# EAGLE design controller (EAGLE 9.2.2)

## Sheet 1 of 3
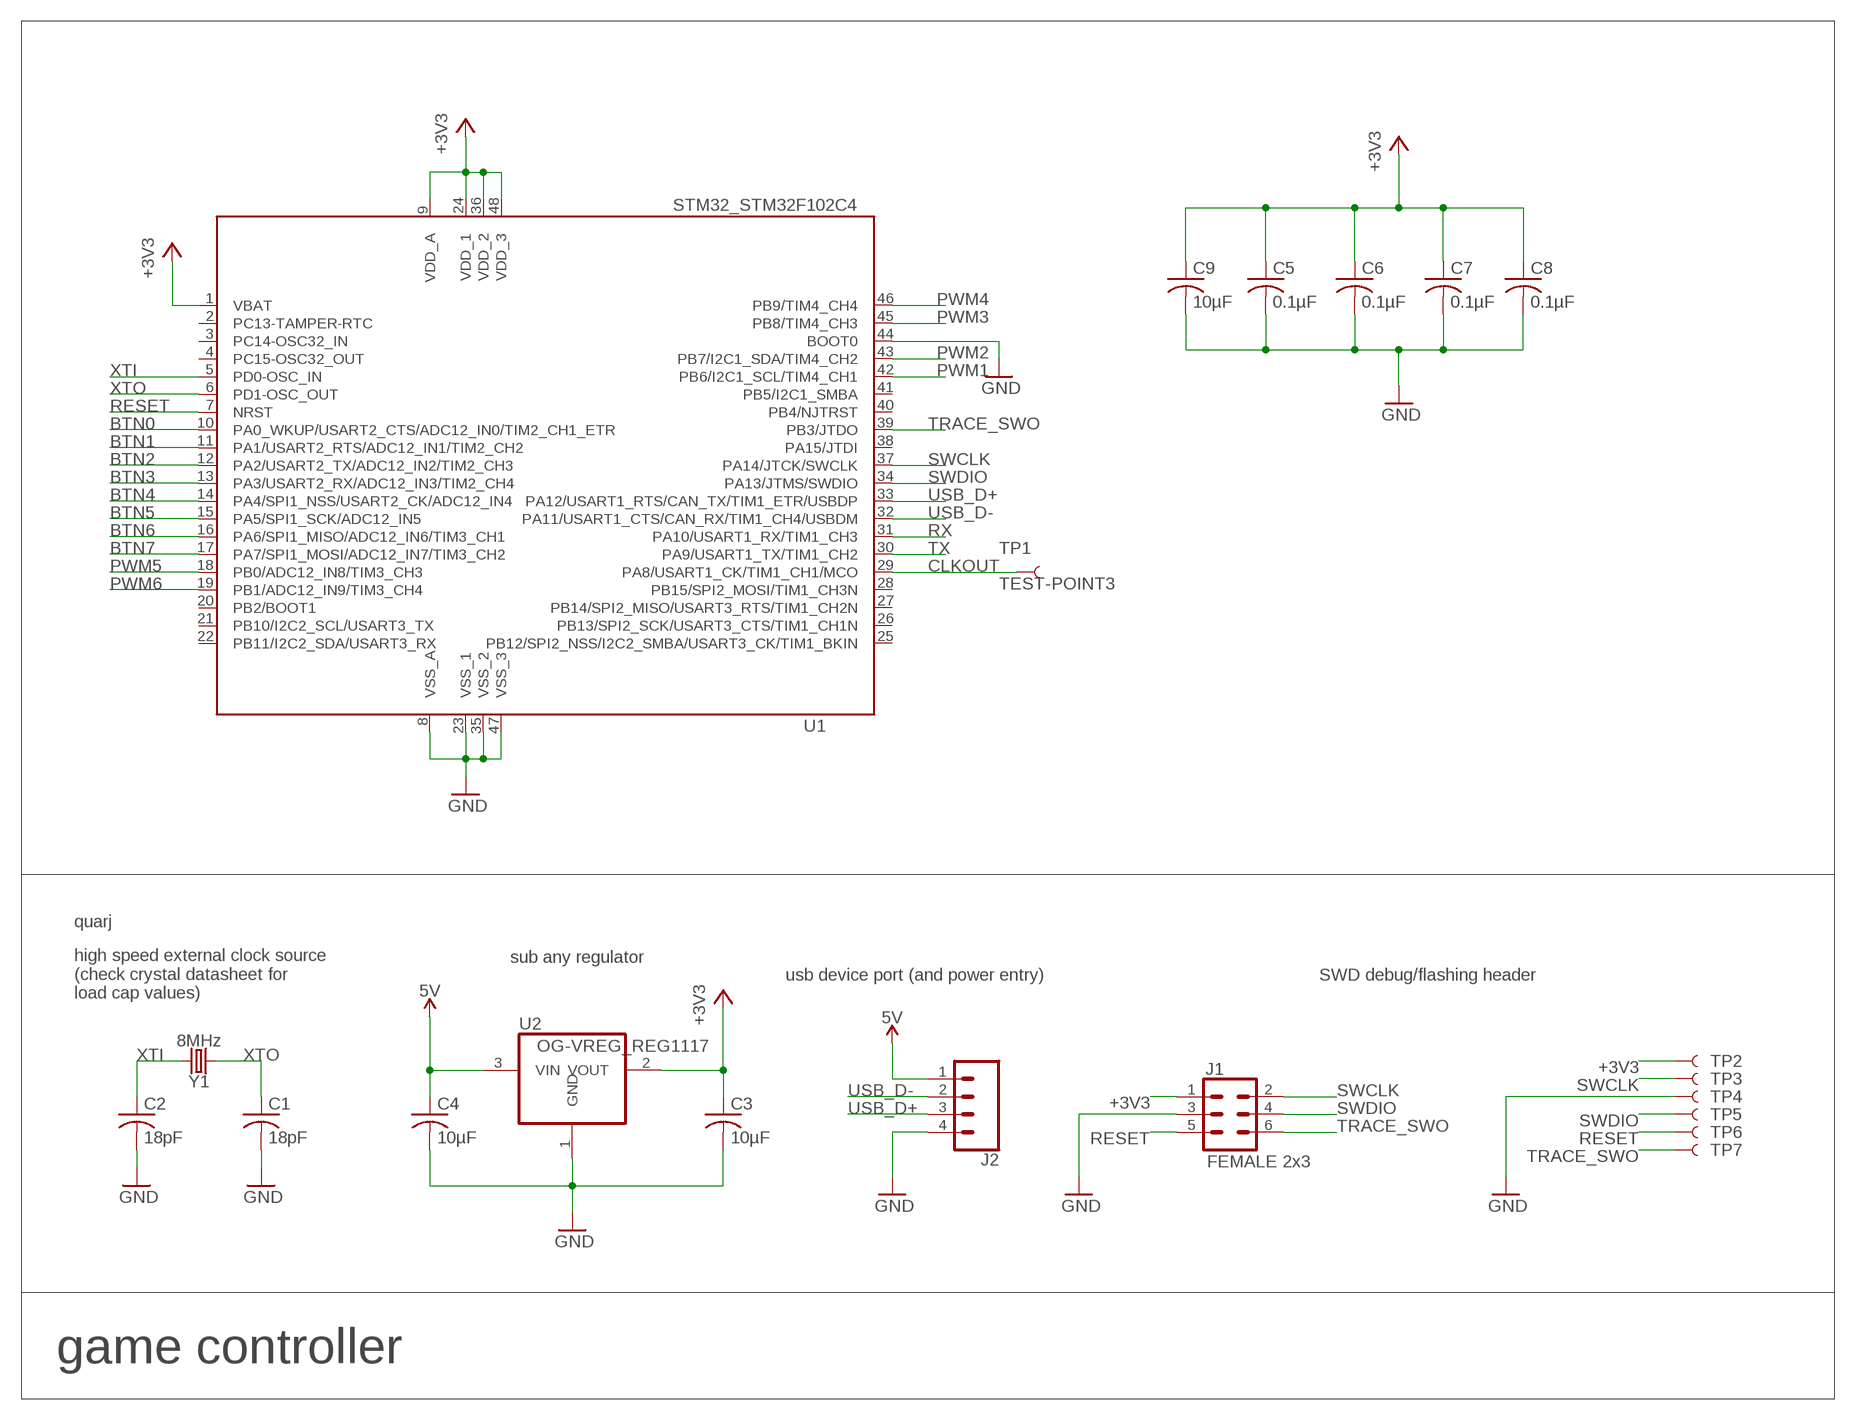
[diagram p0: schematic, sheet 1]

### Parts
C1  18pF  RCL_C-USC0805K  [RCL_C0805K]
C2  18pF  RCL_C-USC0805K  [RCL_C0805K]
C3  10µF  RCL_C-USC0805K  [RCL_C0805K]
C4  10µF  RCL_C-USC0805K  [RCL_C0805K]
C5  0.1µF  RCL_C-USC0805K  [RCL_C0805K]
C6  0.1µF  RCL_C-USC0805K  [RCL_C0805K]
C7  0.1µF  RCL_C-USC0805K  [RCL_C0805K]
C8  0.1µF  RCL_C-USC0805K  [RCL_C0805K]
C9  10µF  RCL_C-USC0805K  [RCL_C0805K]
J1  FEMALE 2x3  CONN_03X2FEMALE  [2X3]
J2  CONN_04  [1X04]
TP1  TEST-POINT3  [PAD.03X.03]
TP2  TEST-POINT3  [PAD.03X.03]
TP3  TEST-POINT3  [PAD.03X.03]
TP4  TEST-POINT3  [PAD.03X.03]
TP5  TEST-POINT3  [PAD.03X.03]
TP6  TEST-POINT3  [PAD.03X.03]
TP7  TEST-POINT3  [PAD.03X.03]
U1  STM32_STM32F102C4  [STM32_LQFP48]
U2  OG-VREG_REG1117  [OG-VREG_SOT223]
Y1  8MHz  CRYSTAL-8MHZSMD-HC49UP  [HC49UP]

### Nets
5V: C4.1 J2.1 U2.3(VIN)
+3V3: C3.1 C5.1 C6.1 C7.1 C8.1 C9.1 J1.1 TP2.P$1 U1.1(VBAT) U1.9(VDD_A) U1.24(VDD_1) U1.36(VDD_2) U1.48(VDD_3) U2.2(VOUT) ; also sheet 2
BTN0: U1.10(PA0_WKUP/USART2_CTS/ADC12_IN0/TIM2_CH1_ETR) ; also sheet 2
BTN1: U1.11(PA1/USART2_RTS/ADC12_IN1/TIM2_CH2) ; also sheet 2
BTN2: U1.12(PA2/USART2_TX/ADC12_IN2/TIM2_CH3) ; also sheet 3
BTN3: U1.13(PA3/USART2_RX/ADC12_IN3/TIM2_CH4) ; also sheet 3
BTN4: U1.14(PA4/SPI1_NSS/USART2_CK/ADC12_IN4) ; also sheet 3
BTN5: U1.15(PA5/SPI1_SCK/ADC12_IN5) ; also sheet 3
BTN6: U1.16(PA6/SPI1_MISO/ADC12_IN6/TIM3_CH1) ; also sheet 3
BTN7: U1.17(PA7/SPI1_MOSI/ADC12_IN7/TIM3_CH2) ; also sheet 3
CLKOUT: TP1.P$1 U1.29(PA8/USART1_CK/TIM1_CH1/MCO)
GND: C1.2 C2.2 C3.2 C4.2 C5.2 C6.2 C7.2 C8.2 C9.2 J1.3 J2.4 TP4.P$1 U1.8(VSS_A) U1.23(VSS_1) U1.35(VSS_2) U1.44(BOOT0) U1.47(VSS_3) U2.1(GND) ; also sheet 2,3
PWM1: U1.42(PB6/I2C1_SCL/TIM4_CH1) ; also sheet 2
PWM2: U1.43(PB7/I2C1_SDA/TIM4_CH2) ; also sheet 2
PWM3: U1.45(PB8/TIM4_CH3) ; also sheet 2
PWM4: U1.46(PB9/TIM4_CH4) ; also sheet 2
PWM5: U1.18(PB0/ADC12_IN8/TIM3_CH3) ; also sheet 2
PWM6: U1.19(PB1/ADC12_IN9/TIM3_CH4) ; also sheet 2
RESET: J1.5 TP6.P$1 U1.7(NRST)
RX: U1.31(PA10/USART1_RX/TIM1_CH3)
SWCLK: J1.2 TP3.P$1 U1.37(PA14/JTCK/SWCLK)
SWDIO: J1.4 TP5.P$1 U1.34(PA13/JTMS/SWDIO)
TRACE_SWO: J1.6 TP7.P$1 U1.39(PB3/JTDO)
TX: U1.30(PA9/USART1_TX/TIM1_CH2)
USB_D+: J2.3 U1.33(PA12/USART1_RTS/CAN_TX/TIM1_ETR/USBDP)
USB_D-: J2.2 U1.32(PA11/USART1_CTS/CAN_RX/TIM1_CH4/USBDM)
XTI: C2.1 U1.5(PD0-OSC_IN) Y1.2
XTO: C1.1 U1.6(PD1-OSC_OUT) Y1.1
Unconnected: U1.2(PC13-TAMPER-RTC) U1.3(PC14-OSC32_IN) U1.4(PC15-OSC32_OUT) U1.20(PB2/BOOT1) U1.21(PB10/I2C2_SCL/USART3_TX) U1.22(PB11/I2C2_SDA/USART3_RX) U1.25(PB12/SPI2_NSS/I2C2_SMBA/USART3_CK/TIM1_BKIN) U1.26(PB13/SPI2_SCK/USART3_CTS/TIM1_CH1N) U1.27(PB14/SPI2_MISO/USART3_RTS/TIM1_CH2N) U1.28(PB15/SPI2_MOSI/TIM1_CH3N) U1.38(PA15/JTDI) U1.40(PB4/NJTRST) U1.41(PB5/I2C1_SMBA)

### Notes on the sheet
- quarj
- sub any regulator
- usb device port (and power entry) | SWD debug/flashing header
- high speed external clock source
  (check crystal datasheet for 
  load cap values)
- game controller

## Sheet 2 of 3
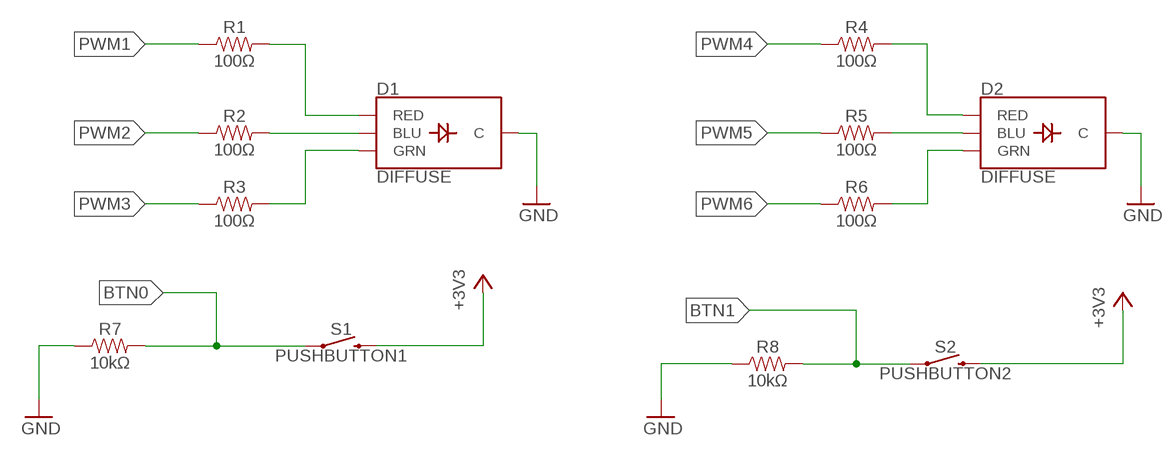
[diagram p1: schematic, sheet 2]

### Parts
D1  DIFFUSE  LED-RGB-CCDIFFUSE  [LED-RGB-THRU]
D2  DIFFUSE  LED-RGB-CCDIFFUSE  [LED-RGB-THRU]
R1  100Ω  0.3OHM-0805-1/8W-1%  [0805]
R2  100Ω  0.3OHM-0805-1/8W-1%  [0805]
R3  100Ω  0.3OHM-0805-1/8W-1%  [0805]
R4  100Ω  0.3OHM-0805-1/8W-1%  [0805]
R5  100Ω  0.3OHM-0805-1/8W-1%  [0805]
R6  100Ω  0.3OHM-0805-1/8W-1%  [0805]
R7  10kΩ  0.3OHM-0805-1/8W-1%  [0805]
R8  10kΩ  0.3OHM-0805-1/8W-1%  [0805]
S1  PUSHBUTTON1  MOMENTARY-SWITCH-SPST-PTH-6.0MM  [TACTILE_SWITCH_PTH_6.0MM]
S2  PUSHBUTTON2  MOMENTARY-SWITCH-SPST-PTH-6.0MM  [TACTILE_SWITCH_PTH_6.0MM]

### Nets
+3V3: S1.3 S2.3 ; also sheet 1
BTN0: R7.2 S1.1 ; also sheet 1
BTN1: R8.2 S2.1 ; also sheet 1
GND: D1.2(C) D2.2(C) R7.1 R8.1 ; also sheet 1,3
N$1: D1.1(RED) R1.2
N$2: D1.4(BLU) R2.2
N$3: D1.3(GRN) R3.2
N$4: D2.4(BLU) R5.2
N$5: D2.1(RED) R4.2
N$6: D2.3(GRN) R6.2
PWM1: R1.1 ; also sheet 1
PWM2: R2.1 ; also sheet 1
PWM3: R3.1 ; also sheet 1
PWM4: R4.1 ; also sheet 1
PWM5: R5.1 ; also sheet 1
PWM6: R6.1 ; also sheet 1

## Sheet 3 of 3
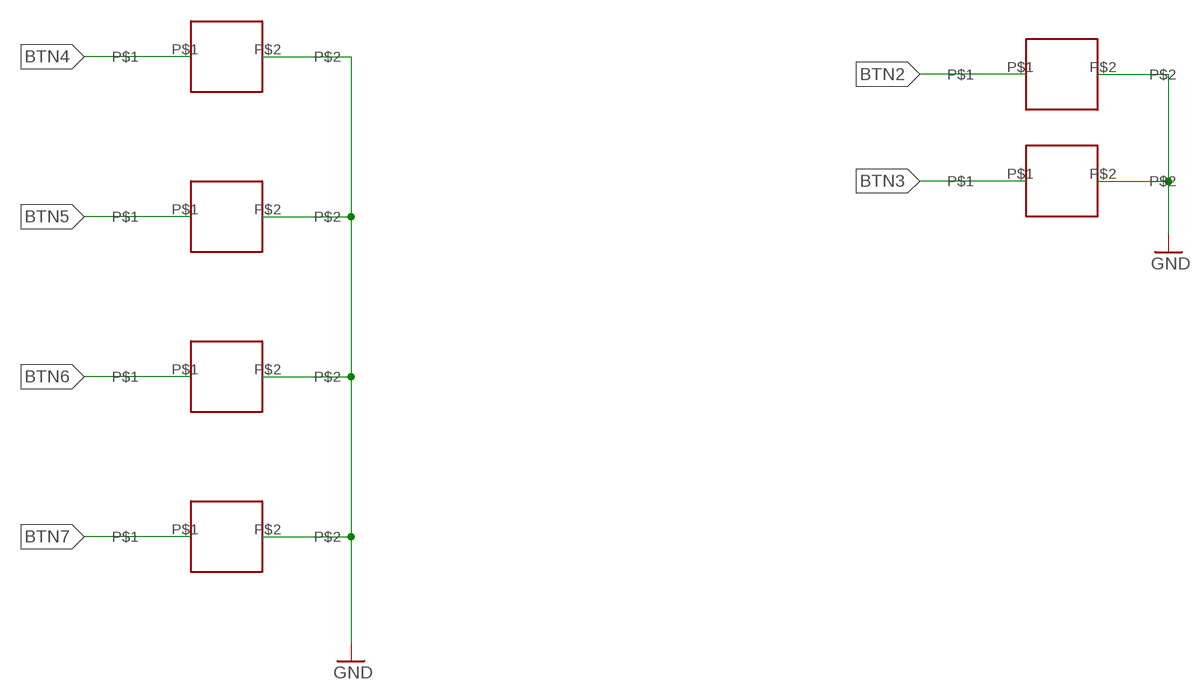
[diagram p2: schematic, sheet 3]

### Parts
A  HYPERKIN_TOUCHPAD_CADET  [HYPERKIN_TOUCHPLATE_CADET]
B  HYPERKIN_TOUCHPAD_CADET  [HYPERKIN_TOUCHPLATE_CADET]
D  HYPERKIN_TOUCHPAD_CADET  [HYPERKIN_TOUCHPLATE_CADET]
L  HYPERKIN_TOUCHPAD_CADET  [HYPERKIN_TOUCHPLATE_CADET]
R  HYPERKIN_TOUCHPAD_CADET  [HYPERKIN_TOUCHPLATE_CADET]
U  HYPERKIN_TOUCHPAD_CADET  [HYPERKIN_TOUCHPLATE_CADET]

### Nets
BTN2: A.P$1 ; also sheet 1
BTN3: B.P$1 ; also sheet 1
BTN4: U.P$1 ; also sheet 1
BTN5: D.P$1 ; also sheet 1
BTN6: L.P$1 ; also sheet 1
BTN7: R.P$1 ; also sheet 1
GND: A.P$2 B.P$2 D.P$2 L.P$2 R.P$2 U.P$2 ; also sheet 1,2

## Library data of the parts
A B D L R U = hyperkin_cadet_touchplate:HYPERKIN_TOUCHPAD_CADET
C1-C9 = braids_v50:RCL_C-US: CAPACITOR, American symbol
D1 D2 = SparkFun-LED:LED-RGB-CC: LED-RGB Common Cathode Packages: LED RGB-THRU LED_PIRANHA_5MM SparkFun Products: RGB Diffused Common Cathode- Diffuse <[https://www.sparkfun.com/products/9264]> RGB Diffused Common Cathode - Clear <[https://www.sparkfun.com/products/105]> LED-RGB 5mm Square (Piranha) <[https://www.sparkfun.com/products/11679]>; PROD_ID: DIO-09434
J1 = SparkFun-Connectors:CONN_03X2: Multi connection point. Often used as Generic Header-pin footprint for 0.1 inch spaced/style header connections You can populate with any combo of single row headers, but if you'd like an exact match, check these: Header - 2x3 (Male, 0.1") <https://www.sparkfun.com/products/12807> (PRT-12807) Header - 2x3 (Female, 0.1") <https://www.sparkfun.com/products/13010> (PRT-13010) 2x3 Pin Shrouded Header <https://www.sparkfun.com/products/10877> (PRT-10877) On any of the 0.1 inch spaced packages, you can populate with these: Break Away Headers - Straight <https://www.sparkfun.com/products/116> (PRT-00116) Break Away Male Headers - Right Angle <https://www.sparkfun.com/products/553> (PRT-00553) Female Headers <https://www.sparkfun.com/products/115> (PRT-00115) Break Away Headers - Machine Pin <https://www.sparkfun.com/products/117> (PRT-00117) Break Away Female Headers - Swiss Machine Pin <https://www.sparkfun.com/products/743> (PRT-00743) Special note: the shrouded connector mates well with our 3x2 ribbon cables: Ribbon Crimp Connector - 6-pin (2x3, Female) <https://www.sparkfun.com/products/10651> (PRT-10651) Ribbon Cable - 6 wire (15ft) <https://www.sparkfun.com/products/10646> (PRT-10646); PROD_ID: CONN-11566
J2 = SparkFun-Connectors:CONN_04: Multi connection point. Often used as Generic Header-pin footprint for 0.1 inch spaced/style header connections On any of the 0.1 inch spaced packages, you can populate with these: Break Away Headers - Straight <https://www.sparkfun.com/products/116> (PRT-00116) Break Away Male Headers - Right Angle <https://www.sparkfun.com/products/553> (PRT-00553) Female Headers <https://www.sparkfun.com/products/115> (PRT-00115) Break Away Headers - Machine Pin <https://www.sparkfun.com/products/117> (PRT-00117) Break Away Female Headers - Swiss Machine Pin <https://www.sparkfun.com/products/743> (PRT-00743) For SCREWTERMINALS and SPRING TERMINALS visit here: Screw Terimnals on SparkFun.com <https://www.sparkfun.com/search/results?term=Screw+Terminals> (5mm/3.5mm/2.54mm spacing) This device is also useful as a general connection point to wire up your design to another part of your project. Our various solder wires solder well into these plated through hole pads. Hook-Up Wire - Assortment (Stranded, 22 AWG) <https://www.sparkfun.com/products/11375> (PRT-11375) Hook-Up Wire - Assortment (Solid Core, 22 AWG) <https://www.sparkfun.com/products/11367> (PRT-11367) View the entire wire category on our website here <https://www.sparkfun.com/categories/141> Special notes: Molex polarized connector foot print use with SKU : PRT-08231 with associated crimp pins and housings. 1MM SMD Version SKU: PRT-10208; PROD_ID: CONN-09696
R1-R8 = SparkFun-Resistors:0.3OHM: 0.3Ω resistor A resistor is a passive two-terminal electrical component that implements electrical resistance as a circuit element. Resistors act to reduce current flow, and, at the same time, act to lower voltage levels within circuits. - Wikipedia; PROD_ID: RES-11622; VALUE: 0.3
S1 S2 = SparkFun-Switches:MOMENTARY-SWITCH-SPST: Momentary Switch (Pushbutton) - SPST Normally-open (NO) SPST momentary switches (buttons, pushbuttons). Variants PTH-12MM - 12mm square, through-hole Momentary Pushbutton Switch - 12mm Square <https://www.sparkfun.com/products/9190> (COM-09190) PTH-6.0MM, PTH-6.0MM-KIT - 6.0mm square, through-hole Mini Pushbutton Switch <https://www.sparkfun.com/products/97> (COM-00097) KIT package intended for soldering kit's - only one side of pads' copper is exposed. PTH-RIGHT-ANGLE-KIT - Right-angle, through-hole Right Angle Tactile Button <https://www.sparkfun.com/products/10791> - Used on SparkFun BigTime Watch Kit <https://www.sparkfun.com/products/11734> SMD-12MM - 12mm square, surface-mount Tactile Button - SMD (12mm) <https://www.sparkfun.com/products/12993> (COM-12993) Used on SparkFun PicoBoard <https://www.sparkfun.com/products/11888> SMD-4.5MM - 4.5mm Square Trackball Switch Used on SparkFun Blackberry Trackballer Breakout <https://www.sparkfun.com/products/13169> SMD-4.6MMX2.8MM - 4.60mm x 2.80mm, surface mount Used on SparkFun SAMD21 Mini Breakout <https://www.sparkfun.com/products/13664> SMD-5.2MM, SMD-5.2-REDUNDANT - 5.2mm square, surface-mount Mini Pushbutton Switch - SMD <https://www.sparkfun.com/products/8720> (COM-08720) Used on Arduino Pro Mini <https://www.sparkfun.com/products/11114> REDUNDANT package connects both switch circuits together SMD-6.0X3.5MM - 6.0 x 3.5mm, surface mount Momentary Reset Switch SMD <https://www.sparkfun.com/products/8229> (COM-08229) SMD-6.2MM-TALL - 6.2mm square, surface mount Tactile Button - SMD (6mm) <https://www.sparkfun.com/products/12992> Used on SparkFun Digital Sandbox <https://www.sparkfun.com/products/12651> SMD-RIGHT-ANGLE - Right-angle, surface mount Used on SparkFun Block for Intel® Edison - Arduino <https://www.sparkfun.com/products/13036>; PROD_ID: SWCH-08441; SF_SKU: COM-00097
TP1-TP7 = SparkFun-Connectors:TEST-POINT: SparkFun Test Points Bare copper test points for troubleshooting or In-Circuit-Testing. These are used by our Production team for verifying production board runs using pogo-pins on test beds. SparkFun Products: SparkFun LSM9DS1 Breakout <https://www.sparkfun.com/products/13284> SparkFun PSOC <https://www.sparkfun.com/products/13714> SparkFun Load Cell Amplifier <https://www.sparkfun.com/products/13879>
U1 = braids_v50:STM32_STM32F102C4
U2 = braids_v50:OG-VREG_REG1117: 800mA and 1A Low Dropout (LDO) Positive Regulator 1.8V, 2.5V, 2.85V, 3.3V, 5V, and Adj
Y1 = SparkFun-Clocks:CRYSTAL-8MHZ: 8MHz Crystal Datasheet Example <http://www.futureelectronics.com/en/technologies/electromechanical/timing-devices/crystals/Pages/6008189-ABM3B-8.000MHZ-B2-T.aspx?IM=0> Frequency: 8MHz Frequency Tolerance: ±20ppm Load Capacitance: 18pF SparkFun Products: Pro Micro -3.3V/8MHz <https://www.sparkfun.com/products/12587> WAV Trigger <https://www.sparkfun.com/products/13660>; PROD_ID: XTAL-11706

## Board
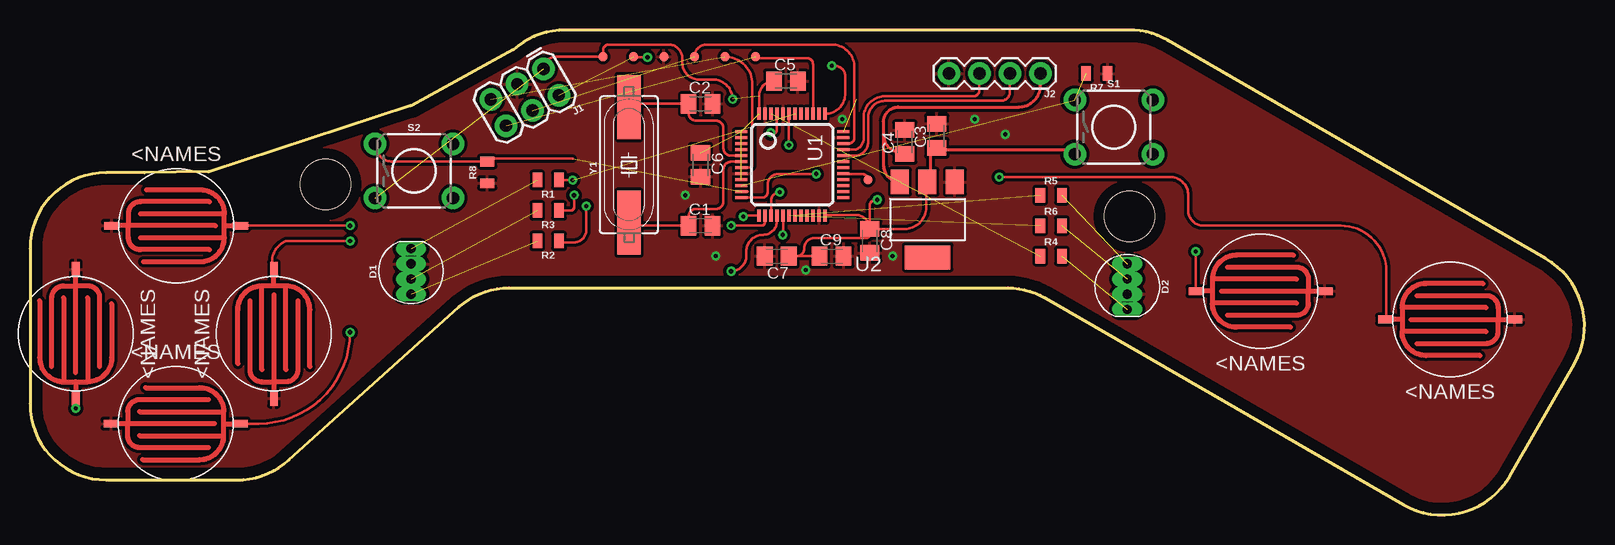
[diagram p3: board, top side]
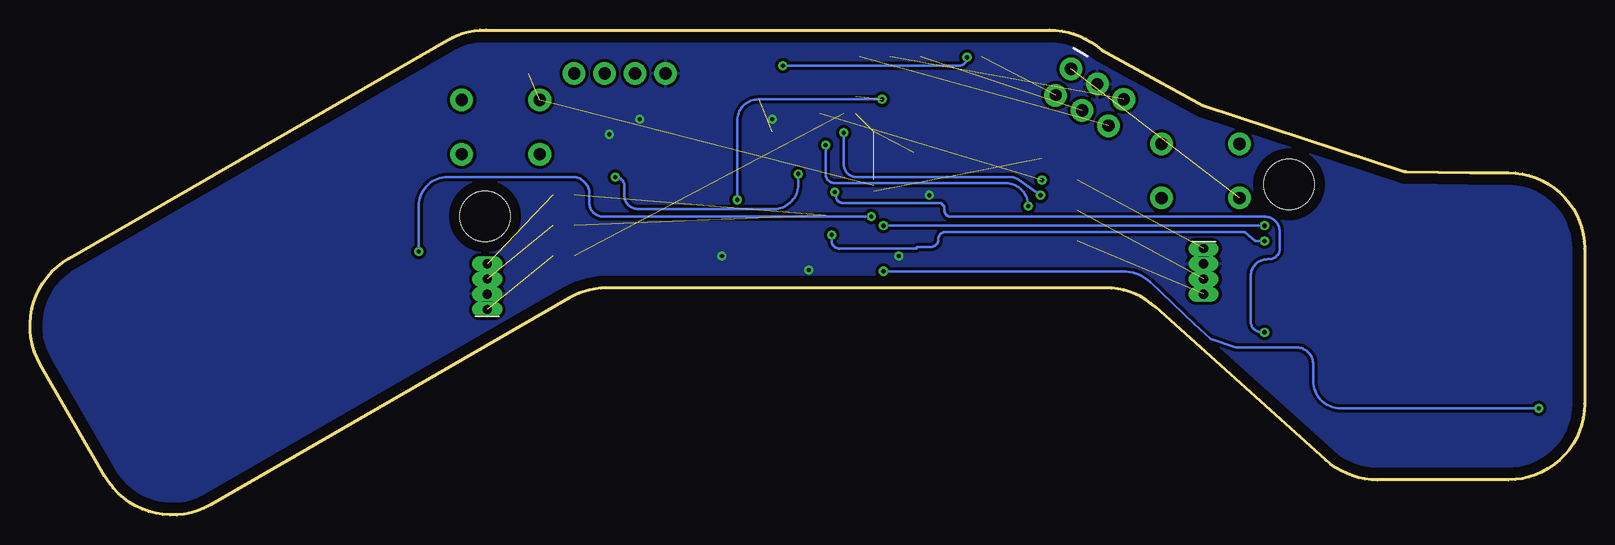
[diagram p4: board, bottom side, seen from below]

Size 129.54 x 40.45 mm. Coordinates in mm from the lower left corner, seen from the top.
Outline: 114.47,0.86 arc90 123.3,3.23 128.68,12.56 arc90 126.32,21.39 94.79,39.59 arc30 91.56,40.45 44.59,40.45 arc42 40.27,38.79 31.79,34.15 31.72,34.12 14.96,28.64 arc-17 14.85,28.62 9.53,28.55 6.35,28.55 arc90 0,22.2 0,9.28 arc90 6.35,2.93 17.25,2.93 arc42 21.58,4.59 35.74,17.33 arc-42 39.91,18.94 81.49,18.94 arc-30 84.61,18.1 114.47,0.86
Copper layers (1*16): Top 0.035mm / dielectric 1.5mm / Bottom 0.035mm
Design rules "default *": minimum track width 6mil, minimum drill 0.35mm, track to track 6mil, track to pad 6mil, pad to pad 6mil, via to via 6mil, smd to smd 6mil, copper to edge 35mil, drill to drill 6mil, minimum pad ring 10mil, minimum via ring 8mil, stop-mask expansion 4mil, vias tented up to drill 0mil, thermal gap 10mil
Holes 4.19 mm at 24.62,27.57 91.64,24.9

### Footprints (pad centres in the part's own frame; a part is rotated, then mirrored left to right if it is on the bottom)
HYPERKIN_TOUCHPLATE_CADET = smd 1.27 x 0.635: P$1 -5.35,0; P$2 5.37,0
RCL_C0805K = smd 1.3 x 1.6: 1 -1,0; 2 1,0
LED-RGB-THRU = drill 0.762 pad 0.889 long: 1 1.905,0; 2 0.635,0; 3 -0.635,0; 4 -1.905,0
2X3 = drill 1.016 pad 1.88: 1 0,0; 2 0,2.54; 3 2.54,0; 4 2.54,2.54; 5 5.08,0; 6 5.08,2.54
1X04 = drill 1.016 pad 1.88: 1 0,0; 2 2.54,0; 3 5.08,0; 4 7.62,0
0805 = smd 0.8 x 1.2: 1 -0.9,0; 2 0.9,0
TACTILE_SWITCH_PTH_6.0MM = drill 1.016 pad 1.88: 1 -3.251,2.261; 2 3.251,2.261; 3 -3.251,-2.261; 4 3.251,-2.261
PAD.03X.03 = smd 0.762 x 0.762: P$1 0,0
STM32_LQFP48 = smd 0.254 x 1: 1 -2.75,-4.25; 2 -2.25,-4.25; 3 -1.75,-4.25; 4 -1.25,-4.25; 5 -0.75,-4.25; 6 -0.25,-4.25; 7 0.25,-4.25; 8 0.75,-4.25; 9 1.25,-4.25; 10 1.75,-4.25; 11 2.25,-4.25; 12 2.75,-4.25; 25 2.75,4.25; 26 2.25,4.25; 27 1.75,4.25; 28 1.25,4.25; 29 0.75,4.25; 30 0.25,4.25; 31 -0.25,4.25; 32 -0.75,4.25; 33 -1.25,4.25; 34 -1.75,4.25; 35 -2.25,4.25; 36 -2.75,4.25 | smd 1 x 0.254: 13 4.25,-2.75; 14 4.25,-2.25; 15 4.25,-1.75; 16 4.25,-1.25; 17 4.25,-0.75; 18 4.25,-0.25; 19 4.25,0.25; 20 4.25,0.75; 21 4.25,1.25; 22 4.25,1.75; 23 4.25,2.25; 24 4.25,2.75; 37 -4.25,2.75; 38 -4.25,2.25; 39 -4.25,1.75; 40 -4.25,1.25; 41 -4.25,0.75; 42 -4.25,0.25; 43 -4.25,-0.25; 44 -4.25,-0.75; 45 -4.25,-1.25; 46 -4.25,-1.75; 47 -4.25,-2.25; 48 -4.25,-2.75
OG-VREG_SOT223 = smd 1.499 x 2.007: 1 -2.261,-3.15; 2 0.025,-3.15; 3 2.311,-3.15 | smd 3.81 x 2.007: 4 0,3.15
HC49UP = smd 5.334 x 1.93: 1 -4.826,0; 2 4.826,0

### Placement (x,y rotation side)
A  118.34,16.3 0 top
B  102.54,18.67 0 top
C1  55.88,24.13 0 top
C2  55.88,34.29 0 top
C3  75.56,31.62 90 top
C4  72.9,31.11 90 top
C5  62.99,36.19 0 top
C6  55.88,29.21 270 top
C7  62.23,21.59 180 top
C8  69.98,22.86 270 top
C9  66.8,21.59 0 top
D  12.14,7.62 180 top
D1  31.75,20.32 90 top
D2  91.44,19.05 270 top
J1  42.8,37.21 210 top
J2  84.2,36.83 180 top
L  3.81,15.11 90 top
R  20.32,15.11 270 top
R1  43.18,27.94 180 top
R2  43.18,22.86 180 top
R3  43.18,25.4 180 top
R4  85.09,21.59 0 top
R5  85.09,26.67 0 top
R6  85.09,24.13 0 top
R7  88.9,36.83 180 top
R8  38.1,28.57 90 top
S1  90.32,32.36 0 top
S2  32,28.7 0 top
TP1  69.85,27.94 0 top
TP2  47.75,38.22 90 top
TP3  50.29,38.22 90 top
TP4  52.83,38.22 90 top
TP5  55.37,38.22 90 top
TP6  57.91,38.22 90 top
TP7  60.45,38.22 90 top
U  12.19,24.13 180 top
U1  63.5,29.21 270 top
U2  74.8,24.63 180 top
Y1  49.91,29.21 90 top

### Tracks (layer width: path | path; a pad name or v marks a point on that pad's centre or on a via)
5V
  Top 0.254: U2.3 arc-90 71.12,29.16 71.12,31.75 | 71.12,31.75 71.12,32.76 arc-90 72.39,34.03 82.42,34.03 arc90 84.2,35.81 J2.1 | C4.1 72.9,30.22 72.64,30.22 arc-90 71.12,31.75
+3V3  (via drill 0.35)  (6 unrouted)
  Top 0.203: U1.24 arc-90 66.31,25.02 68.83,25.02 arc-90 69.98,23.87 C8.1 | C5.1 arc90 60.75,34.95 U1.48 | C8.1 arc-90 69.87,23.75 | U2.2 arc-90 74.68,27.68 74.68,25.65 arc-90 72.88,23.86 C8.1 | C9.1 C7.1 63.88,21.59 arc90 64.52,22.22 arc-90 65.41,23.11 69.72,23.11 arc90 69.98,23.36 C8.1 | C8.1 69.98,25.78 arc-90 70.48,26.29 v70.61,26.29 | v58.55,34.67 arc90 56.9,36.32 55.75,36.32 arc-90 54.36,37.72 54.36,38.1 arc90 53.21,39.24 48.26,39.24 arc90 47.75,38.73 TP2.P$1 43.81,38.22 arc90 J1.1
  Top 0.254: U2.2 arc90 75.06,28.06 75.06,30.35 arc-90 75.33,30.62 C3.1 arc90 75.71,30.48 86.69,30.48 arc-90 S1.3
  Bottom 0.203: v70.61,26.29 70.61,32.89 arc90 68.83,34.67 v58.55,34.67
BTN0  (2 unrouted)
BTN1  (1 unrouted)
  Top 0.203: U1.11 arc-90 59.27,26.97 59.82,26.97 | S2.1 arc90 30.24,29.47 R8.2 arc-90 38.34,29.71 45.21,29.71
BTN2  (via drill 0.35)
  Top 0.203: A.P$1 arc90 113.03,16.34 113.03,20.32 arc90 109.22,24.13 97.79,24.13 arc-90 96.52,25.4 96.52,26.67 arc90 95,28.19 v80.77,28.19 | U1.12 61,26.46 arc90 61.47,26.92 61.47,27.56 arc-90 62.36,28.44 v65.53,28.44
  Bottom 0.203: v80.77,28.19 arc90 80.01,27.43 80.01,26.67 arc-90 78.87,25.52 67.56,25.52 arc-90 65.53,27.56 v65.53,28.44
BTN3  (via drill 0.35)
  Top 0.203: B.P$1 arc-90 97.16,18.7 v97.16,21.97 | v59.44,24.89 arc-90 59.5,24.96 U1.13
  Bottom 0.203: v97.16,21.97 97.16,25.78 arc90 94.74,28.19 84.33,28.19 arc90 82.93,26.79 82.93,26.03 arc-90 81.79,24.89 v59.44,24.89
BTN4  (via drill 0.35)
  Top 0.203: U.P$1 v26.67,24.13 | v58.42,24.13 60.96,24.13 arc90 61.25,24.42 U1.14
  Bottom 0.203: v26.67,24.13 v58.42,24.13
BTN5  (via drill 0.35)
  Top 0.203: v26.67,15.24 arc-90 19.05,7.62 D.P$1 | v62.48,26.92 arc90 61.75,26.19 U1.15
  Bottom 0.203: v62.48,26.92 arc-90 62.36,26.79 62.36,26.54 arc-90 61.85,26.03 53.85,26.03 arc90 53.34,25.52 53.34,25.4 arc-90 52.83,24.89 26.67,24.89 arc90 25.4,23.62 25.4,22.22 arc90 26.29,21.33 26.42,21.33 arc-90 27.81,19.94 27.81,16.13 arc-90 26.92,15.24 v26.67,15.24
BTN6  (via drill 0.35)
  Top 0.203: L.P$1 v3.81,8.89 | v58.42,20.33 arc90 59.69,21.6 59.69,21.97 arc-90 61.09,23.36 arc90 62.25,24.53 U1.16
  Bottom 0.203: v3.81,8.89 20.32,8.89 arc90 22.61,11.17 22.61,12.57 arc-90 24,13.97 29.08,13.97 31.14,14.7 32.51,15.93 36.2,19.43 arc-40 38.23,20.32 v58.42,20.32 v58.42,20.33
BTN7  (via drill 0.35)
  Top 0.203: R.P$1 arc-90 21.32,22.86 v26.67,22.86 | v62.74,23.36 arc90 v62.75,23.38 U1.17
  Bottom 0.203: v26.67,22.86 27.43,22.86 28.32,23.62 53.21,23.62 arc-90 53.85,22.98 arc90 54.48,22.35 55.63,22.35 arc90 55.75,22.22 62.1,22.22 arc90 62.74,22.86 v62.74,23.36
CLKOUT
  Top 0.203: U1.29 arc90 67.76,28.44 69.34,28.44 arc-90 TP1.P$1
GND  (via drill 0.35)
  other vias: 54.61,26.67 71.88,21.59 57.15,21.59 64.64,20.44 78.74,33.02 81.28,31.75 67.69,33.02
  pour Top (isolate 0.254): 6.35,2.54 17.78,2.54 arc37 21.59,3.81 arc11 35.56,16.51 arc-53 40.77,18.54 81.28,18.54 83.82,17.78 115.7,-0.64 arc95 123.06,1.65 129.92,13.33 arc79 128.78,20.32 93.47,40.89 43.56,40.89 arc43 41.27,40 31.75,34.67 15.24,29.21 5.71,29.08 arc96 -0.64,21.84 -0.51,8.63 arc90 5.59,2.54
  pour Bottom (isolate 0.254): 5.08,2.54 17.78,2.54 arc37 21.59,3.81 arc11 35.56,16.51 arc-35 38.86,18.41 arc-16 40.64,18.54 81.28,18.54 83.82,17.78 106.3,4.82 115.06,-0.26 arc54 119.51,-0.51 arc34 123.95,3.3 arc3 129.54,12.7 arc73 128.52,20.44 93.98,40.64 93.47,40.89 43.56,40.89 arc43 41.27,40 32,34.79 15.24,29.21 4.95,29.08 arc90 -0.64,23.49 -0.64,20.06 -0.64,8.63 arc86
N$1  (1 unrouted)
N$2  (1 unrouted)
N$3  (1 unrouted)
N$4  (1 unrouted)
N$5  (1 unrouted)
N$6  (1 unrouted)
PWM1  (via drill 0.35)  (1 unrouted)
  Top 0.203: R1.1 v45.21,27.94
PWM2  (via drill 0.35)
  Top 0.203: R2.1 arc90 44.21,22.73 45.34,22.73 arc90 46.35,23.75 v46.35,25.78 | U1.43 arc90 U1.43 v63.25,30.86
  Bottom 0.203: v46.35,25.78 arc-90 48.26,27.68 62.48,27.68 arc90 63.25,28.44 v63.25,30.86
PWM3  (via drill 0.35)
  Top 0.203: R3.1 45.09,25.4 arc90 45.34,25.65 v45.34,26.67 | U1.45 arc90 62.23,33.44 62.23,32.13 arc-90 61.85,31.75 v61.72,31.87
  Bottom 0.203: v45.34,26.67 47.12,27.94 arc-39 48.01,28.19 60.71,28.19 arc90 61.72,29.21 v61.72,31.87
PWM4  (1 unrouted)
PWM5  (1 unrouted)
PWM6  (1 unrouted)
RESET  (1 unrouted)
  Top 0.203: U1.7 59.95,28.96 arc90 60.2,29.21 60.2,35.94 arc90 TP6.P$1
SWCLK  (via drill 0.35)  (1 unrouted)
  Top 0.203: U1.37 arc90 67.94,35.15 67.94,36.57 arc90 67.06,37.46 v66.8,37.46 | v51.46,38.17 50.35,38.17 arc-90 TP3.P$1
  Bottom 0.203: v51.46,38.17 arc90 52.17,37.46 v66.8,37.46
SWDIO  (1 unrouted)
  Top 0.203: U1.34 68.17,30.96 arc90 68.71,31.49 68.71,37.33 arc90 66.8,39.24 56.39,39.24 arc90 TP5.P$1
TRACE_SWO  (1 unrouted)
  Top 0.203: U1.39 65.25,37.62 arc90 64.77,38.1 60.58,38.1 arc-90 TP7.P$1
USB_D+
  Top 0.203: U1.33 68.56,30.46 arc90 69.47,31.37 69.47,33.14 arc-90 71.25,34.92 78.61,34.92 arc90 79.12,35.43 J2.3
USB_D-
  Top 0.203: U1.32 68.69,29.96 arc90 69.85,31.11 69.85,33.14 arc-90 71.25,34.54 80.9,34.54 arc90 81.66,35.3 J2.2
XTI
  Top 0.203: Y1.2 arc-90 50.16,34.29 C2.1 54.88,33.51 arc90 55.5,32.89 57.15,32.89 arc-90 57.78,32.25 57.78,30.6 arc90 58.43,29.96 U1.5
XTO
  Top 0.203: Y1.1 arc90 50.16,24.13 C1.1 54.88,24.9 arc-90 55.5,25.52 57.15,25.52 arc90 57.78,26.16 57.78,28.83 arc-90 58.42,29.46 U1.6 arc-90 U1.6